# Altium project LO2.PrjPcb
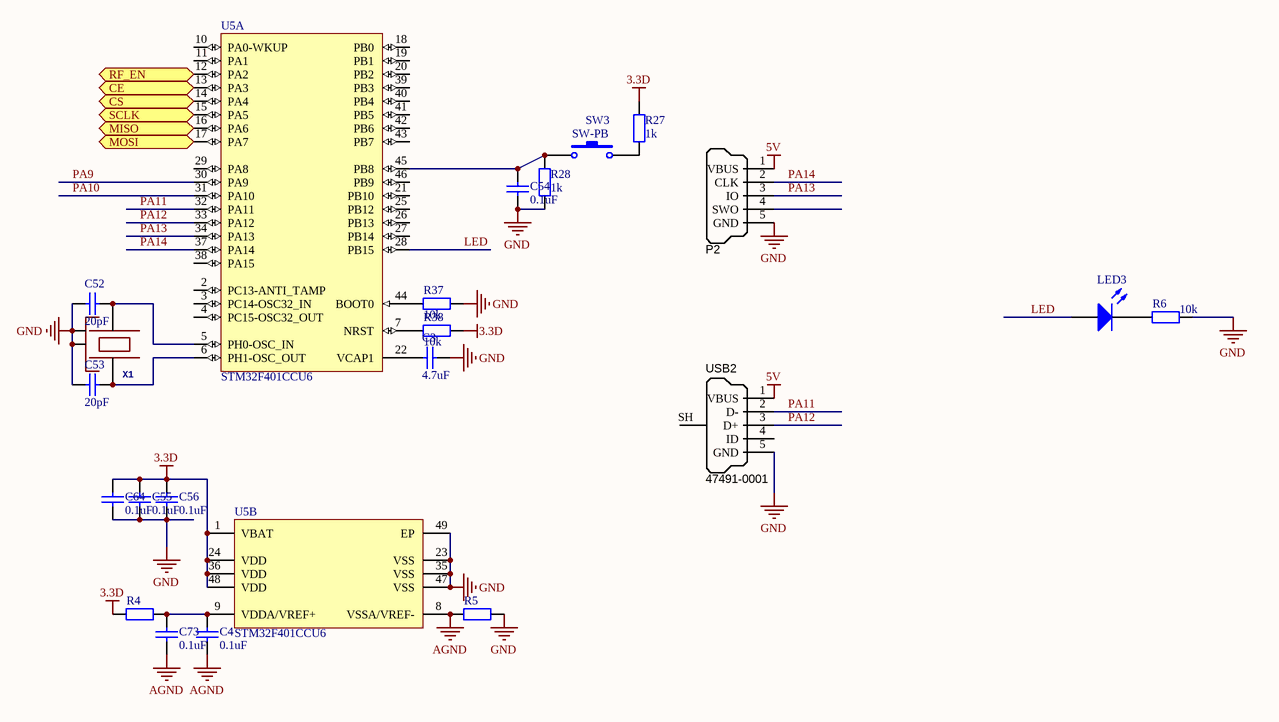
[diagram p0: mcu.SchDoc]
4 sheets, 133 parts. Net scope: flat (ports and power ports of the same name join across sheets).
Board file: LO2.PcbDoc
Sheets:
  mcu.SchDoc
  source.SchDoc
  power.SchDoc
  mixer.SchDoc

## Sheet mcu.SchDoc
size A4

### Parts
C3  value 4.7uF  [0603]  (hidden comment: Cap)
C4  value 0.1uF  [0402]  (hidden comment: Cap)
C52  value 20pF  [0402]  (hidden comment: Cap)
C53  value 20pF  [0402]  (hidden comment: Cap)
C54  value 0.1uF  [0402]  (hidden comment: Cap)
C55  value 0.1uF  [0402]  (hidden comment: Cap)
C56  value 0.1uF  [0402]  (hidden comment: Cap)
C64  value 0.1uF  [0402]  (hidden comment: Cap)
C73  value 0.1uF  [0402]  (hidden comment: Cap)
LED3  LED0  [0603]  (value not drawn)
P2  SWD_MicroUSB  [MICRO-YZX]  (value not drawn)
R4  0R/FB  [0402]  (value not drawn)
R5  0R/FB  [0402]  (value not drawn)
R6  10k  [0402]
R27  1k  [0402]
R28  1k  [0402]
R37  value 10k  [0402]  (hidden comment: Res2)
R38  value 10k  [0402]  (hidden comment: Res2)
SW3  SW-PB  [SW3x4]
U5  STM32F401CCU6  [STM-UFQFPN48_N]  (parts A,B of 2)
USB2  Manufacturer Part Number 1: 47491-0001  [MICRO-YZX]  (hidden comment: USB Micro Type B)
X1  24.000 KHz 3.2x2.5mm 8-10pf  [OSCILLATOR-3.2X2.5]  (value not drawn)

### Ports
CE, CS, MISO, MOSI, RF_EN, SCLK

### Nets
3.3D: C55.2 C56.2 C64.2 R4.2 R27.2 R38.1 U5.1(VBAT) U5.24(VDD) U5.36(VDD) U5.48(VDD)
5V: P2.1(VBUS) USB2.1(VBUS)
AGND: C4.1 C73.1 R5.2 U5.8(VSSA/VREF-)
GND: C3.1 C52.1 C53.1 C54.1 C55.1 C56.1 C64.1 P2.5(GND) R5.1 R6.2 R28.1 R37.2 U5.23(VSS) U5.35(VSS) U5.47(VSS) U5.49(EP) USB2.5(GND) X1.2(NC_2) X1.4(NC_4)
LED: LED3.1(A) U5.28(PB15)
PA9: U5.30(PA9)
PA10: U5.31(PA10)
PA11: U5.32(PA11) USB2.2(D-)
PA12: U5.33(PA12) USB2.3(D+)
PA13: P2.3(IO) U5.34(PA13)
PA14: P2.2(CLK) U5.37(PA14)
NetC3_2: C3.2 U5.22(VCAP1)
NetC4_2: C4.2 C73.2 R4.1 U5.9(VDDA/VREF+)
NetC52_2: C52.2 U5.5(PH0-OSC_IN) X1.1
NetC53_2: C53.2 U5.6(PH1-OSC_OUT) X1.3
NetC54_2: C54.2 R28.2 SW3.1 U5.45(PB8)
NetLED3_2: LED3.2(K) R6.1
NetR12_1: U5.13(PA3) ; port CE
NetR14_1: U5.12(PA2) ; port RF_EN
NetR27_1: R27.1 SW3.2
NetR37_1: R37.1 U5.44(BOOT0)
NetR38_2: R38.2 U5.7(NRST)
NetU5_14: U5.14(PA4) ; port CS
NetU5_15: U5.15(PA5) ; port SCLK
NetU5_16: U5.16(PA6) ; port MISO
NetU5_17: U5.17(PA7) ; port MOSI

Not connected (* = marked no-connect by the designer): P2 4(SWO); U5 2(PC13-ANTI_TAMP) 3(PC14-OSC32_IN) 4(PC15-OSC32_OUT) 10(PA0-WKUP) 11(PA1) 18(PB0) 19(PB1) 20(PB2) 21(PB10) 25(PB12) 26(PB13) 27(PB14) 29(PA8) 38(PA15) 39(PB3) 40(PB4) 41(PB5) 42(PB6) 43(PB7) 46(PB9); USB2 4(ID) SH(Shell)

### Library data of the parts
C3 C4 C52-C56 C64 C73 = Cap: Capacitor; Published: 8-Jun-2000; LatestRevisionDate: 17-Jul-2002; LatestRevisionNote: Re-released for DXP Platform.; PackageReference: RAD-0.3; Publisher: Altium Limited; PackageDescription: Radial Cap, Thru-Hole; 2 Leads; 0.3 in Pin Spacing
LED3 = LED0: Typical INFRARED GaAs LED; Published: 8-Jun-2000; LatestRevisionDate: 08-Jul-2005; LatestRevisionNote: Mech Layer 1 removed.; PackageReference: LED-0; Publisher: Altium Limited; PackageDescription: LED; 2 Leads
P2 = SWD_MicroUSB: Connector SMD USB Micro Type B middle mount; Manufacturer 1: Molex Inc; SCDType: undef; Package / Case: SMD; Supplier 1: Digi-Key; Supplier Part Number 1: WM17142CT-ND
R4 R5 R37 R38 = Res2: Resistor; Published: 8-Jun-2000; LatestRevisionDate: 17-Jul-2002; LatestRevisionNote: Re-released for DXP Platform.; PackageReference: AXIAL-0.4; Publisher: Altium Limited; PackageDescription: Axial Device, Thru-Hole; 2 Leads; 0.4 in Pin Spacing
R6 R27 R28 = Res2: Resistor; Value: 0Ohm; Published: 8-Jun-2000; LatestRevisionDate: 17-Jul-2002; LatestRevisionNote: Re-released for DXP Platform.; PackageReference: AXIAL-0.4; Publisher: Altium Limited; PackageDescription: Axial Device, Thru-Hole; 2 Leads; 0.4 in Pin Spacing
SW3 = SW-PB: Switch; Published: 24-Mar-1999; LatestRevisionDate: 17-Jul-2002; LatestRevisionNote: Re-released for DXP Platform.; PackageReference: SPST-2; Publisher: Altium Limited; PackageDescription: Switch; 2 Leads
U5 = STM32F401CCU6: ARM Cortex-M4 32-bit MCU+FPU, 105 DMIPS, 256 kB Flash, 64 kB Internal RAM, 36 I/Os, 48-pin UFQFPN, -40 to 85 degC, Tray; Manufacturer: STMicroelectronics; FLASH Size (Prog) (kB): 256; I/Os (High Current): 36; Internal RAM Size (kB): 64; Operating Frequency(F) (Processor speed) (MHz): 84; Supply Voltage(Vcc) max (V): 3.6; Supply Voltage(Vcc) min (V): 1.8; DatasheetVersion: Rev. 1; PackageVersion: Rev. 1, 04/2013; PackageReference: UFQFPN48; PackageDescription: 48-Pin Ultra Thin Fine Pitch Quad Flat No-Lead, 7 x 7 x 0.6 mm Body, 0.5 mm Pitch, Exposed Pad; Supplier 1: Newark; Supplier Part Number 1: 19X6217; Supplier 2: Mouser; Supplier Part Number 2: 511-STM32F401CCU6; Core: ARM Cortex-M4; Packing: Tray; Mounting Technology: Surface Mount; PartNumber: STM32F401CCU6; ComponentLink1Description: Manufacturer URL; ComponentLink1URL: http://www.st.com/web/en/home.html; ComponentLink2Description: Datasheet; ComponentLink2URL: http://www.st.com/st-web-ui/static/active/en/resource/technical/document/data_brief/DM00071938.pdf; ComponentLink3Description: Package Specification; ComponentLink3URL: http://www.st.com/st-web-ui/static/active/en/resource/technical/document/data_brief/DM00071938.pdf
USB2 = USB_Micro_TypeB: Connector SMD USB Micro Type B middle mount; Manufacturer 1: Molex Inc; SCDType: undef; Package / Case: SMD; Supplier 1: Digi-Key; Supplier Part Number 1: WM17142CT-ND
X1 = OSCILLATOR-3.2X2.5: Crystal Oscillator in 3.2x2.5 SMD

## Sheet source.SchDoc
size A4
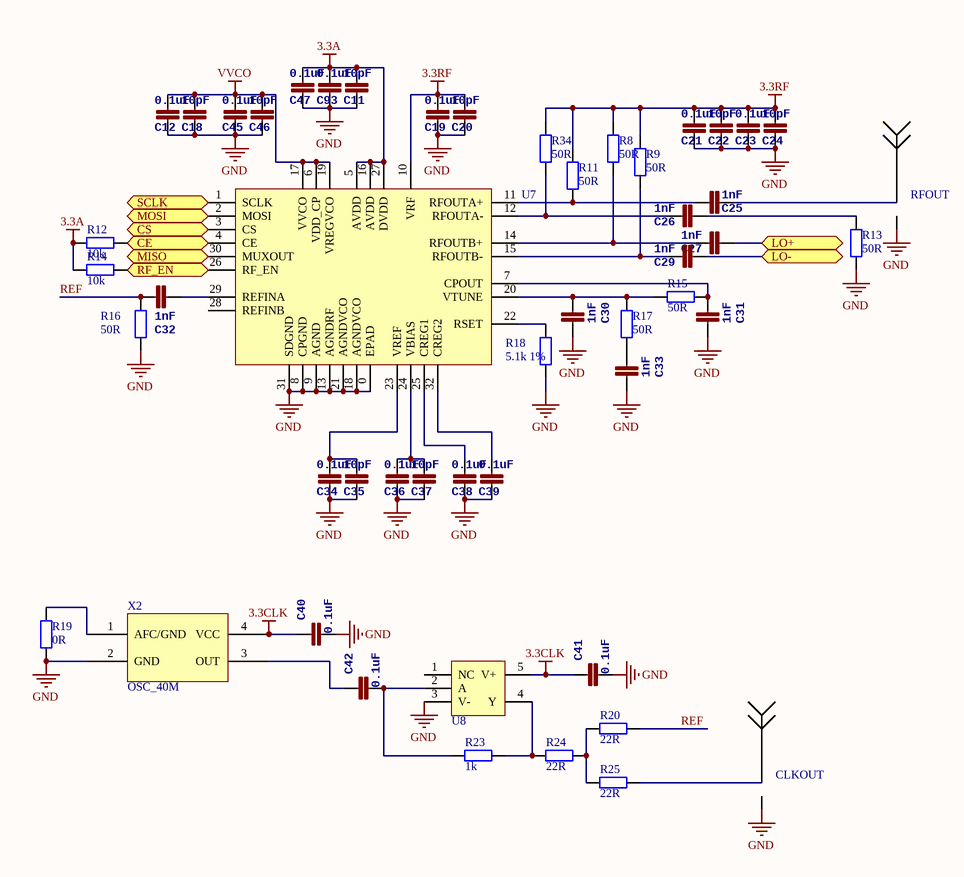
[diagram p1: source.SchDoc]

### Parts
C11  10pF  [0402]
C12  0.1uF  [0402]
C18  10pF  [0402]
C19  0.1uF  [0402]
C20  10pF  [0402]
C21  0.1uF  [0402]
C22  10pF  [0402]
C23  0.1uF  [0402]
C24  10pF  [0402]
C25  1nF  [0402]
C26  1nF  [0402]
C27  1nF  [0402]
C29  1nF  [0402]
C30  1nF  [0402]
C31  1nF  [0402]
C32  1nF  [0402]
C33  1nF  [0402]
C34  0.1uF  [0402]
C35  10pF  [0402]
C36  0.1uF  [0402]
C37  10pF  [0402]
C38  0.1uF  [0402]
C39  0.1uF  [0402]
C40  0.1uF  [0402]
C41  0.1uF  [0402]
C42  0.1uF  [0402]
C45  0.1uF  [0402]
C46  10pF  [0402]
C47  0.1uF  [0402]
C93  0.1uF  [0402]
CLKOUT  Antenna  [SMA-2B]  (value not drawn)
R8  50R  [0402]
R9  50R  [0402]
R11  50R  [0402]
R12  10k  [0402]
R13  50R  [0402]
R14  10k  [0402]
R15  50R  [0402]
R16  50R  [0402]
R17  50R  [0402]
R18  5.1k 1%  [0402]
R19  0R  [0402]
R20  22R  [0402]
R23  1k  [0402]
R24  22R  [0402]
R25  22R  [0402]
R34  50R  [0402]
RFOUT  Antenna  [SMA-2B]  (value not drawn)
U7  ADF4355  [ADF4351]  (value not drawn)
U8  74-1G04  [SOT23-5]  (value not drawn)
X2  OSC_40M  [TXC_7Q]

### Ports
CE, CS, LO+, LO-, MISO, MOSI, RF_EN, SCLK

### Nets
3.3A: C11.1 C47.1 C93.1 R12.2 R14.2 U7.5(AVDD) U7.16(AVDD) U7.27(DVDD)
3.3CLK: C40.1 C41.1 U8.5(V+) X2.4(VCC)
3.3RF: C19.1 C20.1 C21.1 C22.1 C23.1 C24.1 R8.2 R9.2 R11.2 R34.2 U7.10(VRF)
GND: C11.2 C12.2 C18.2 C19.2 C20.2 C21.2 C22.2 C23.2 C24.2 C30.2 C31.2 C33.2 C34.2 C35.2 C36.2 C37.2 C38.2 C39.2 C40.2 C41.2 C45.2 C46.2 C47.2 C93.2 CLKOUT.GND(G) R13.2 R16.1 R18.1 R19.2 RFOUT.GND(G) U7.0(EPAD) U7.8(CPGND) U7.9(AGND) U7.13(AGNDRF) U7.18(AGNDVCO) U7.21(AGNDVCO) U7.31(SDGND) U8.3(V-) X2.2(GND)
VVCO: C12.1 C18.1 C45.1 C46.1 U7.6(VDD_CP) U7.17(VVCO) U7.19(VREGVCO)
REF: C32.2 R16.2 R20.2
NetC25_1: C25.1 R11.1 U7.11(RFOUTA+)
NetC25_2: C25.2 RFOUT.1
NetC26_1: C26.1 R13.1
NetC26_2: C26.2 R34.1 U7.12(RFOUTA-)
NetC27_1: C27.1 ; port LO+
NetC27_2: C27.2 R8.1 U7.14(RFOUTB+)
NetC29_1: C29.1 ; port LO-
NetC29_2: C29.2 R9.1 U7.15(RFOUTB-)
NetC30_1: C30.1 R15.1 R17.1 U7.20(VTUNE)
NetC31_1: C31.1 R15.2 U7.7(CPOUT)
NetC32_1: C32.1 U7.29(REFINA)
NetC33_1: C33.1 R17.2
NetC34_1: C34.1 C35.1 U7.23(VREF)
NetC36_1: C36.1 C37.1 U7.24(VBIAS)
NetC38_1: C38.1 U7.25(CREG1)
NetC39_1: C39.1 U7.32(CREG2)
NetC42_1: C42.1 X2.3(OUT)
NetC42_2: C42.2 R23.1 U8.2(A)
NetCLKOUT_1: CLKOUT.1 R25.2
NetR12_1: R12.1 U7.4(CE) ; port CE
NetR14_1: R14.1 U7.26(RF_EN) ; port RF_EN
NetR18_2: R18.2 U7.22(RSET)
NetR19_1: R19.1 X2.1(AFC/GND)
NetR20_1: R20.1 R24.2 R25.1
NetR23_2: R23.2 R24.1 U8.4(Y)
NetU5_14: U7.3(CS) ; port CS
NetU5_15: U7.1(SCLK) ; port SCLK
NetU5_16: U7.30(MUXOUT) ; port MISO
NetU5_17: U7.2(MOSI) ; port MOSI

Not connected (* = marked no-connect by the designer): U7 28(REFINB); U8 1(NC)

### Library data of the parts
C11 C12 C18-C27 C29-C42 C45-C47 C93 = CAP0402-CAP: <b>Capacitor</b> / Standard 0603 ceramic capacitor, and 0.1" leaded capacitor.; PARTNO: CC0402ZRY5V7BB104
R8 R9 R11-R20 R23-R25 R34 = Res2: Resistor; Value: 0Ohm; Published: 8-Jun-2000; LatestRevisionDate: 17-Jul-2002; LatestRevisionNote: Re-released for DXP Platform.; PackageReference: AXIAL-0.4; Publisher: Altium Limited; PackageDescription: Axial Device, Thru-Hole; 2 Leads; 0.4 in Pin Spacing

## Sheet power.SchDoc
size A4
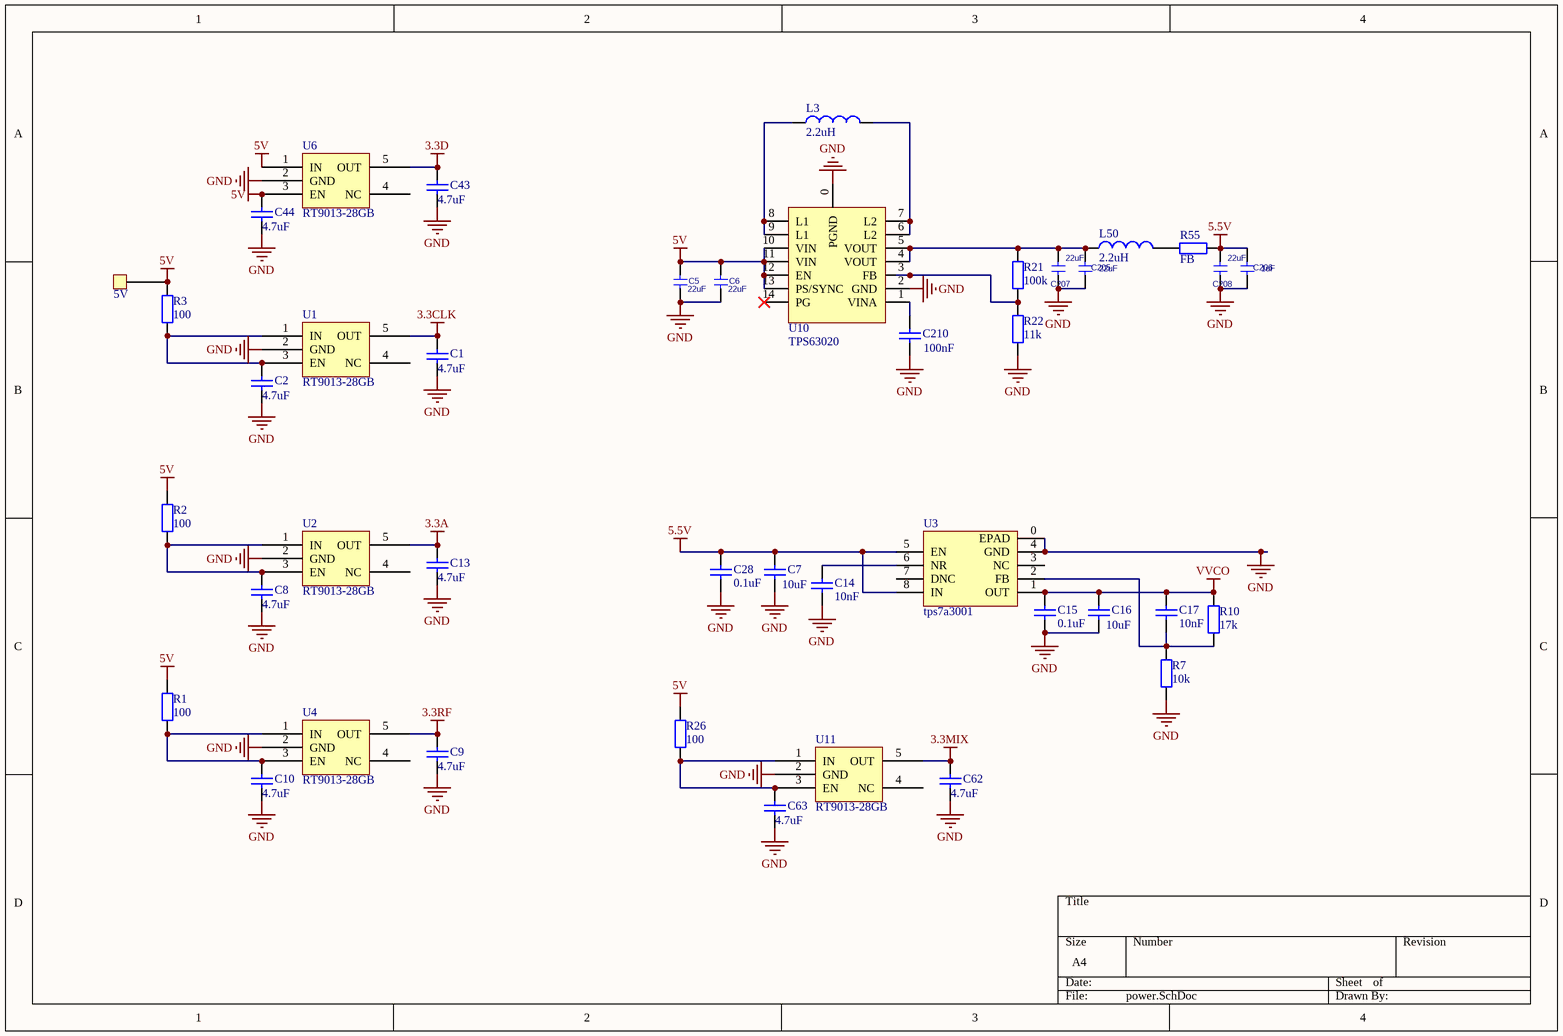
[diagram p2: power.SchDoc]

### Parts
5V  TestPad  [TestPad]  (value not drawn)
C1  4.7uF  [0603]
C2  4.7uF  [0603]
C5  22uF  [0805]
C6  22uF  [0805]
C7  10uF  [0805]
C8  4.7uF  [0603]
C9  4.7uF  [0603]
C10  4.7uF  [0603]
C13  4.7uF  [0603]
C14  10nF  [0402]
C15  0.1uF  [0603L]
C16  10uF  [0805]
C17  10nF  [0402]
C28  0.1uF  [0603L]
C43  4.7uF  [0603]
C44  4.7uF  [0603]
C62  4.7uF  [0603]
C63  4.7uF  [0603]
C205  22uF  [0805]
C206  1uF  [0805]
C207  22uF  [0805]
C208  22uF  [0805]
C210  100nF  [0402]
L3  2.2uH  [L4015]
L50  2.2uH  [L4015]
R1  100  [0603]
R2  100  [0603]
R3  100  [0603]
R7  10k  [0402]
R10  17k  [0402]
R21  100k  [0402]
R22  11k  [0402]
R26  100  [0603]
R55  FB  [0603L]
U1  RT9013-28GB  [SOT23-5]
U2  RT9013-28GB  [SOT23-5]
U3  tps7a3001  [MSOP8/VSSOP8+PAD]
U4  RT9013-28GB  [SOT23-5]
U6  RT9013-28GB  [SOT23-5]
U10  TPS63020  [TPS63020]
U11  RT9013-28GB  [SOT23-5]

### Nets
3.3A: C13.2 U2.5(OUT)
3.3CLK: C1.2 U1.5(OUT)
3.3D: C43.2 U6.5(OUT)
3.3MIX: C62.2 U11.5(OUT)
3.3RF: C9.2 U4.5(OUT)
5.5V: C7.2 C28.1 C206.1 C208.1 R55.1 U3.5(EN) U3.8(IN)
5V: 5V.1 C5.1 C6.1 C44.2 R1.2 R2.2 R3.2 R26.2 U6.1(IN) U6.3(EN) U10.10(VIN) U10.11(VIN) U10.12(EN) U10.13(PS/SYNC)
GND: C1.1 C2.1 C5.2 C6.2 C7.1 C8.1 C9.1 C10.1 C13.1 C14.2 C15.2 C16.1 C28.2 C43.1 C44.1 C62.1 C63.1 C205.2 C206.2 C207.2 C208.2 C210.2 R7.1 R22.2 U1.2(GND) U2.2(GND) U3.0(EPAD) U3.4(GND) U4.2(GND) U6.2(GND) U10.0(PGND) U10.2(GND) U11.2(GND)
VVCO: C15.1 C16.2 C17.1 R10.2 U3.1(OUT)
NetC2_2: C2.2 R3.1 U1.1(IN) U1.3(EN)
NetC8_2: C8.2 R2.1 U2.1(IN) U2.3(EN)
NetC10_2: C10.2 R1.1 U4.1(IN) U4.3(EN)
NetC14_1: C14.1 U3.6(NR)
NetC17_2: C17.2 R7.2 R10.1 U3.2(FB)
NetC63_2: C63.2 R26.1 U11.1(IN) U11.3(EN)
NetC205_1: C205.1 C207.1 L50.1 R21.1 U10.4(VOUT) U10.5(VOUT)
NetC210_1: C210.1 U10.1(VINA)
NetL3_1: L3.1 U10.8(L1) U10.9(L1)
NetL3_2: L3.2 U10.6(L2) U10.7(L2)
NetL50_2: L50.2 R55.2
NetR21_2: R21.2 R22.1 U10.3(FB)

Not connected (* = marked no-connect by the designer): U1 4(NC); U2 4(NC); U3 3(NC) 7(DNC); U4 4(NC); U6 4(NC); U10 14(PG)*; U11 4(NC)

### Library data of the parts
C1 C2 C7-C10 C13-C17 C28 C43 C44 C62 C63 C210 = Cap: Capacitor; Published: 8-Jun-2000; LatestRevisionDate: 17-Jul-2002; LatestRevisionNote: Re-released for DXP Platform.; PackageReference: RAD-0.3; Publisher: Altium Limited; PackageDescription: Radial Cap, Thru-Hole; 2 Leads; 0.3 in Pin Spacing
C5 C6 C205-C208 = C: PCB DECAL: C0805; Source_Path: C:\USERS\EULER-SJ\DESKTOP\CHEN-PI2\LIBRARY1.OLB; Value: 10uF/16V; PSpiceTemplate: C^@REFDES %1 %2 ?TOLERANCE|C^@REFDES| @VALUE ?IC/IC=@IC/ ?TOLERANCE|\n.model C^@REFDES CAP C=1 DEV=@TOLERANCE%|
L3 L50 = Inductor: Code_IEC: 1005; Published: 8-Jun-2000; LatestRevisionDate: 29-May-2009; LatestRevisionNote: IPC-7351 Footprint Added.; PackageReference: 0402-A; Publisher: Altium Limited; PackageDescription: Chip Inductor; Code_JEITA: 0402
R1-R3 R26 R55 = Res2: Resistor; Value: 0Ohm; Published: 8-Jun-2000; LatestRevisionDate: 17-Jul-2002; LatestRevisionNote: Re-released for DXP Platform.; PackageReference: AXIAL-0.4; Publisher: Altium Limited; PackageDescription: Axial Device, Thru-Hole; 2 Leads; 0.4 in Pin Spacing
R7 R10 R21 R22 = Res2: Resistor; Published: 8-Jun-2000; LatestRevisionDate: 17-Jul-2002; LatestRevisionNote: Re-released for DXP Platform.; PackageReference: AXIAL-0.4; Publisher: Altium Limited; PackageDescription: Axial Device, Thru-Hole; 2 Leads; 0.4 in Pin Spacing
U1 U2 U4 U6 U11 = LP5907

## Sheet mixer.SchDoc
size A4
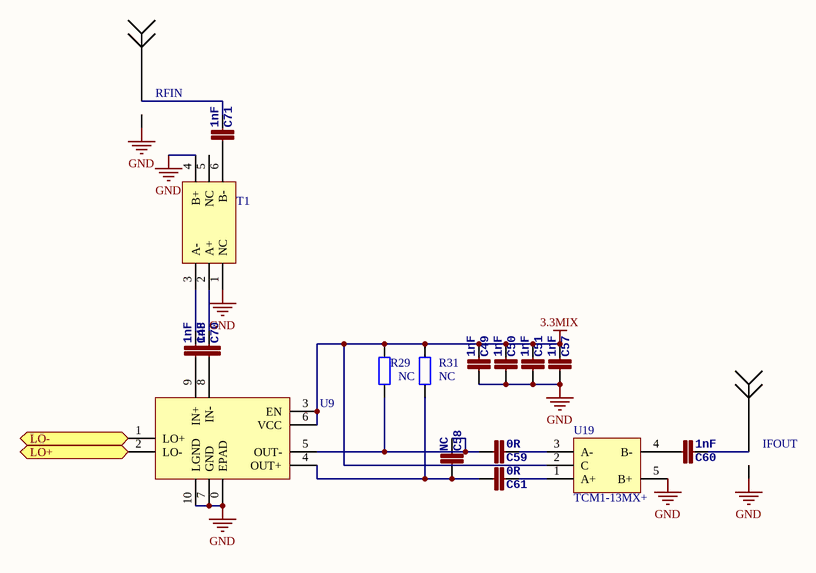
[diagram p3: mixer.SchDoc]

### Parts
C48  1nF  [0402]
C49  1nF  [0402]
C50  1nF  [0402]
C51  1nF  [0402]
C57  1nF  [0402]
C58  NC  [0402]
C59  0R  [0402]
C60  1nF  [0402]
C61  0R  [0402]
C70  1nF  [0402]
C71  1nF  [0402]
IFOUT  Antenna  [SMA-2B]  (value not drawn)
R29  NC  [0402]
R31  NC  [0402]
RFIN  Antenna  [SMA-2B]  (value not drawn)
T1  TCM1-63AX+  [TCM1-63AX+]  (value not drawn)
U9  LTC5562  [LTC5562]  (value not drawn)
U19  TCM1-13MX+  [TCM-13M+]

### Ports
LO+, LO-

### Nets
3.3MIX: C49.2 C50.2 C51.2 C57.2 R29.2 R31.2 U9.3(EN) U9.6(VCC) U19.2(C)
GND: C49.1 C50.1 C51.1 C57.1 IFOUT.GND(G) RFIN.GND(G) T1.1(NC) T1.4(B+) U9.0(EPAD) U9.7(GND) U9.10(LGND) U19.5(B+)
NetC27_1: U9.2(LO-) ; port LO+
NetC29_1: U9.1(LO+) ; port LO-
NetC48_1: C48.1 U9.9(IN+)
NetC48_2: C48.2 T1.3(A-)
NetC58_1: C58.1 C61.1 R31.1 U9.4(OUT+)
NetC58_2: C58.2 C59.1 R29.1 U9.5(OUT-)
NetC59_2: C59.2 U19.3(A-)
NetC60_1: C60.1 U19.4(B-)
NetC60_2: C60.2 IFOUT.1
NetC61_2: C61.2 U19.1(A+)
NetC70_1: C70.1 U9.8(IN-)
NetC70_2: C70.2 T1.2(A+)
NetC71_1: C71.1 T1.6(B-)
NetC71_2: C71.2 RFIN.1

Not connected (* = marked no-connect by the designer): T1 5(NC)

### Library data of the parts
C48-C51 C57-C61 C70 C71 = CAP0402-CAP: as C11 on sheet source
R29 R31 = Res2: Resistor; Published: 8-Jun-2000; LatestRevisionDate: 17-Jul-2002; LatestRevisionNote: Re-released for DXP Platform.; PackageReference: AXIAL-0.4; Publisher: Altium Limited; PackageDescription: Axial Device, Thru-Hole; 2 Leads; 0.4 in Pin Spacing
U19 = TCM-63AX+

## Nets that join several sheets
3.3A: source (8 pins), power (C13.2 U2.5)
3.3CLK: source (C40.1 C41.1 U8.5 X2.4), power (C1.2 U1.5)
3.3D: mcu (10 pins), power (C43.2 U6.5)
3.3MIX: power (C62.2 U11.5), mixer (9 pins)
3.3RF: source (11 pins), power (C9.2 U4.5)
5V: mcu (P2.1 USB2.1), power (14 pins)
GND: mcu (19 pins), source (39 pins), power (33 pins), mixer (12 pins)
VVCO: source (7 pins), power (5 pins)
NetC27_1: source (C27.1), mixer (U9.2)
NetC29_1: source (C29.1), mixer (U9.1)
NetR12_1: mcu (U5.13), source (R12.1 U7.4)
NetR14_1: mcu (U5.12), source (R14.1 U7.26)
NetU5_14: mcu (U5.14), source (U7.3)
NetU5_15: mcu (U5.15), source (U7.1)
NetU5_16: mcu (U5.16), source (U7.30)
NetU5_17: mcu (U5.17), source (U7.2)